# EAGLE design SG_CAN_Board_2018 (EAGLE 8.4.2)
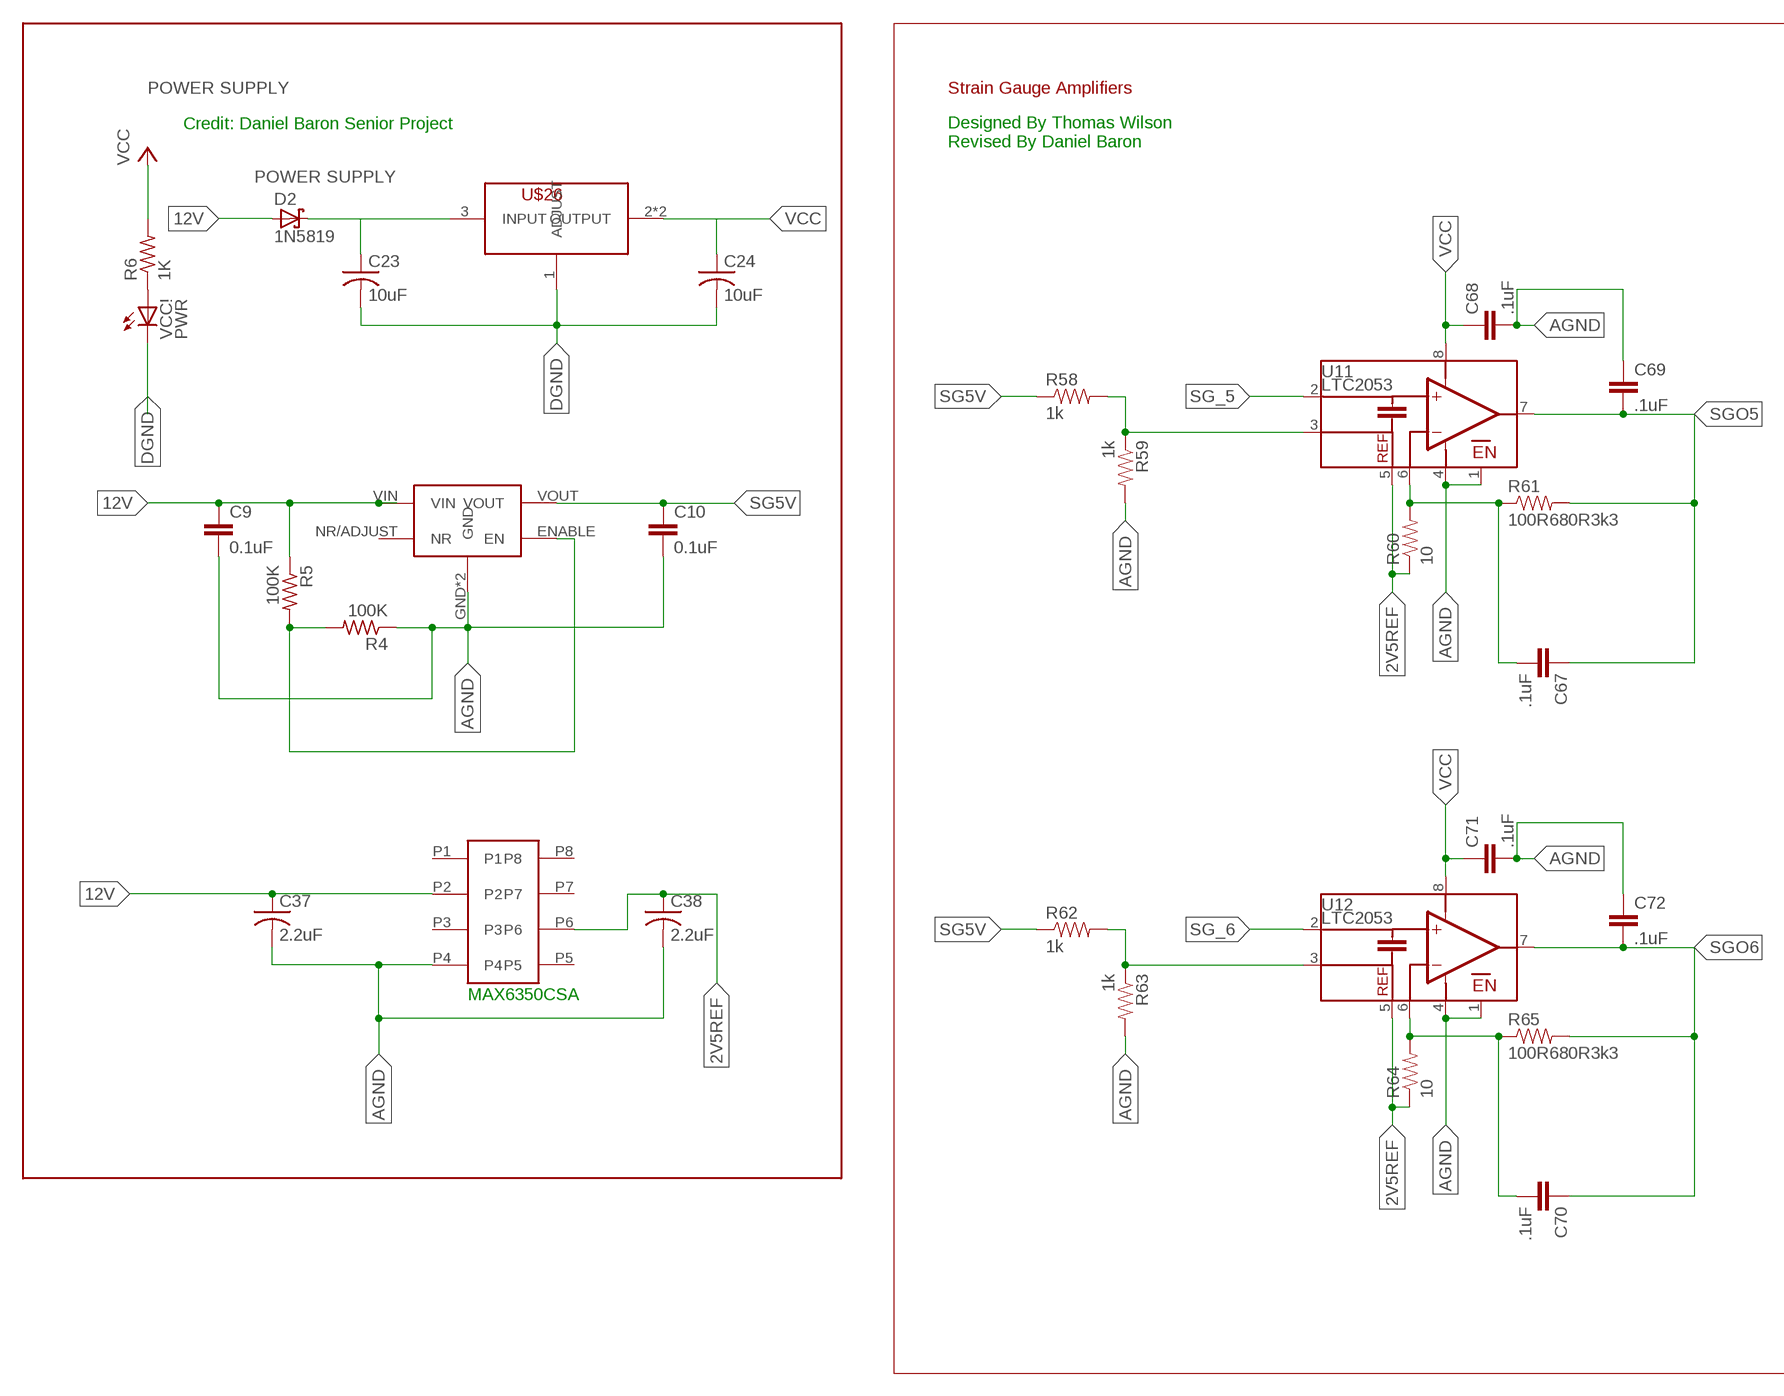
[diagram p0: schematic, sheet 1, part 1 of 2]
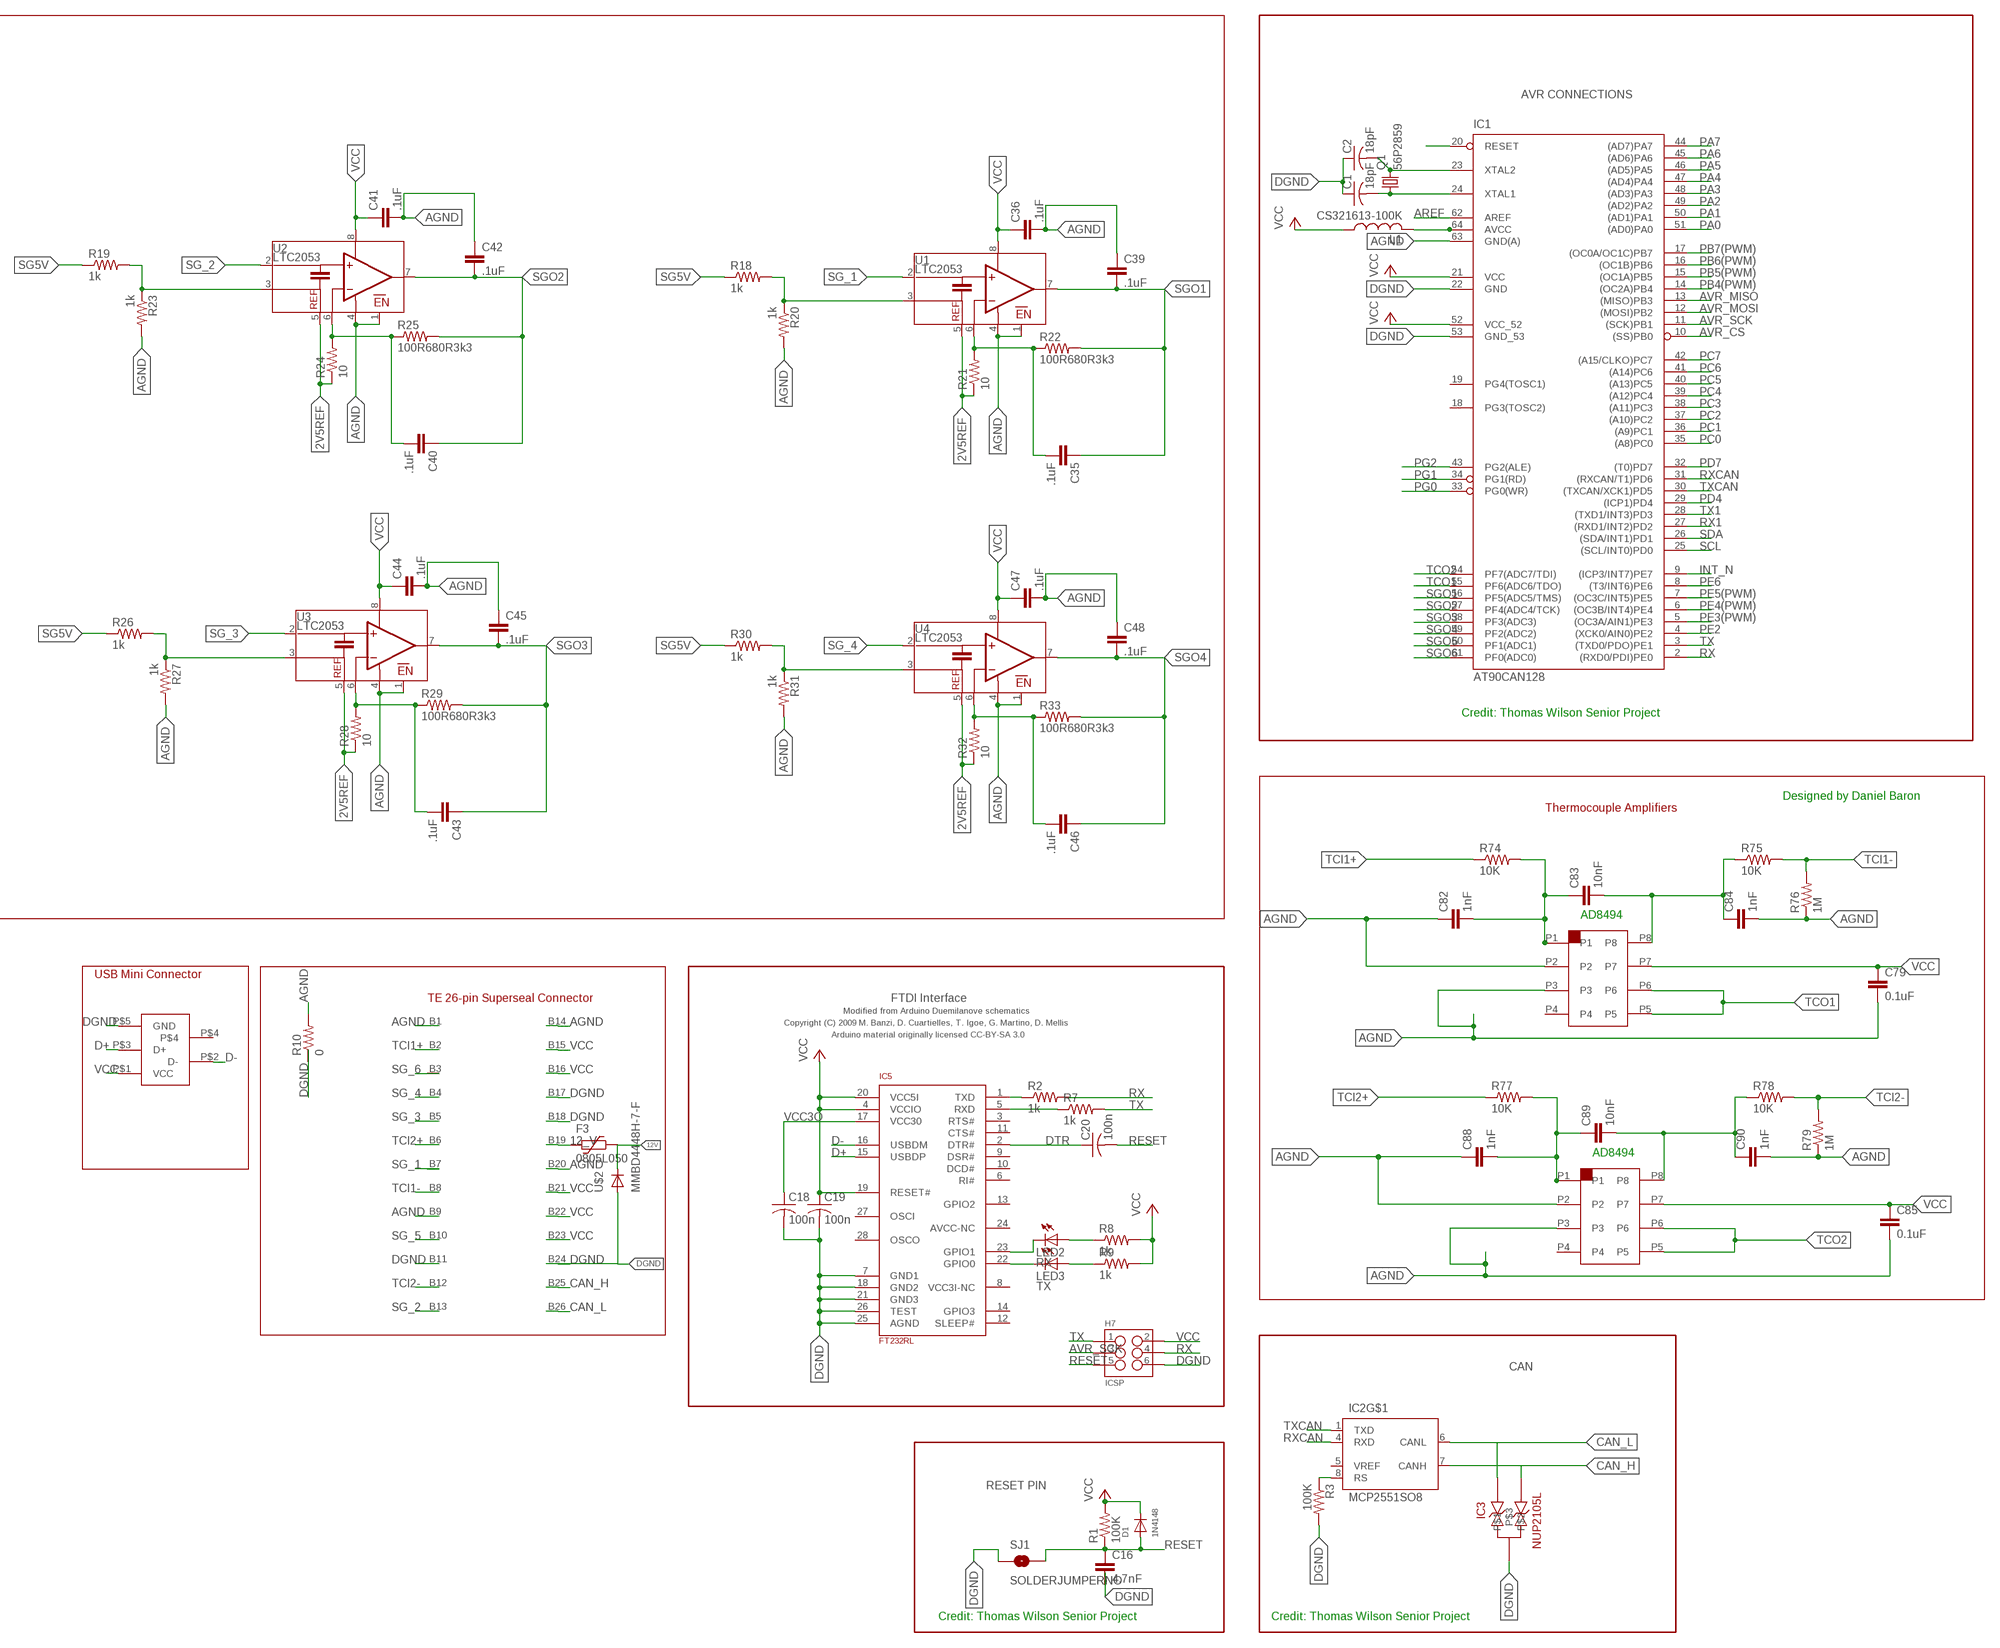
[diagram p1: schematic, sheet 1, part 2 of 2]

## Parts
C1  18pF  C-USC0805  [C0805]
C2  18pF  C-USC0805  [C0805]
C9  0.1uF  C-EUC0603  [C0603]
C10  0.1uF  C-EUC0603  [C0603]
C16  4.7nF  CAP0603-CAP  [0603-CAP]
C18  100n  C-USC0805  [C0805]
C19  100n  C-USC0805  [C0805]
C20  100n  C-USC0805  [C0805]
C23  10uF  C-USC0603  [C0603]
C24  10uF  C-USC0603  [C0603]
C35  .1uF  CAP0603-CAP  [0603-CAP]
C36  .1uF  CAP0603-CAP  [0603-CAP]
C37  2.2uF  C-USC0603  [C0603]
C38  2.2uF  C-USC0603  [C0603]
C39  .1uF  CAP0603-CAP  [0603-CAP]
C40  .1uF  CAP0603-CAP  [0603-CAP]
C41  .1uF  CAP0603-CAP  [0603-CAP]
C42  .1uF  CAP0603-CAP  [0603-CAP]
C43  .1uF  CAP0603-CAP  [0603-CAP]
C44  .1uF  CAP0603-CAP  [0603-CAP]
C45  .1uF  CAP0603-CAP  [0603-CAP]
C46  .1uF  CAP0603-CAP  [0603-CAP]
C47  .1uF  CAP0603-CAP  [0603-CAP]
C48  .1uF  CAP0603-CAP  [0603-CAP]
C67  .1uF  CAP0603-CAP  [0603-CAP]
C68  .1uF  CAP0603-CAP  [0603-CAP]
C69  .1uF  CAP0603-CAP  [0603-CAP]
C70  .1uF  CAP0603-CAP  [0603-CAP]
C71  .1uF  CAP0603-CAP  [0603-CAP]
C72  .1uF  CAP0603-CAP  [0603-CAP]
C79  0.1uF  C-EUC0603  [C0603]
C82  1nF  C-EUC0603  [C0603]
C83  10nF  C-EUC0603  [C0603]
C84  1nF  C-EUC0603  [C0603]
C85  0.1uF  C-EUC0603  [C0603]
C88  1nF  C-EUC0603  [C0603]
C89  10nF  C-EUC0603  [C0603]
C90  1nF  C-EUC0603  [C0603]
D1  1N4148  DIODESOD-123  [SOD-123]
D2  1N5819  1N5819-B  [DO41-7.6]
F3  0805L050  [0805L]
H7  ICSP  M03X2SMD_FCI  [2X3_SMD_FCI_54202-G30]
IC1  AT90CAN128  [TQFP64]
IC2  MCP2551SO8  [SO08]
IC3  NUP2105L  [SOT-23]
IC5  FT232RL  [SSOP28]
L1  CS321613-100K  L-USL3216C  [L3216C]
LED2  RX  LEDCHIPLED_0805  [CHIPLED_0805]
LED3  TX  LEDCHIPLED_0805  [CHIPLED_0805]
Q1  56P2859  CRYSTALSMD  [HC49UP]
R1  100K  R-US_R0805  [R0805]
R2  1k  R-US_R0805  [R0805]
R3  100K  R-US_R0805  [R0805]
R4  100K  R-US_M0805  [M0805]
R5  100K  R-US_M0805  [M0805]
R6  1K  R-US_R0805  [R0805]
R7  1k  R-US_R0805  [R0805]
R8  1k  R-US_R0805  [R0805]
R9  1k  R-US_R0805  [R0805]
R10  0  RESISTOR0603  [0603-RES]
R18  1k  RESISTOR0603  [0603-RES]
R19  1k  RESISTOR0603  [0603-RES]
R20  1k  RESISTOR0603  [0603-RES]
R21  10  RESISTOR0603  [0603-RES]
R22  100R680R3k3  RESISTOR0603  [0603-RES]
R23  1k  RESISTOR0603  [0603-RES]
R24  10  RESISTOR0603  [0603-RES]
R25  100R680R3k3  RESISTOR0603  [0603-RES]
R26  1k  RESISTOR0603  [0603-RES]
R27  1k  RESISTOR0603  [0603-RES]
R28  10  RESISTOR0603  [0603-RES]
R29  100R680R3k3  RESISTOR0603  [0603-RES]
R30  1k  RESISTOR0603  [0603-RES]
R31  1k  RESISTOR0603  [0603-RES]
R32  10  RESISTOR0603  [0603-RES]
R33  100R680R3k3  RESISTOR0603  [0603-RES]
R58  1k  RESISTOR0603  [0603-RES]
R59  1k  RESISTOR0603  [0603-RES]
R60  10  RESISTOR0603  [0603-RES]
R61  100R680R3k3  RESISTOR0603  [0603-RES]
R62  1k  RESISTOR0603  [0603-RES]
R63  1k  RESISTOR0603  [0603-RES]
R64  10  RESISTOR0603  [0603-RES]
R65  100R680R3k3  RESISTOR0603  [0603-RES]
R74  10K  RESISTOR0603  [0603-RES]
R75  10K  RESISTOR0603  [0603-RES]
R76  1M  RESISTOR0603  [0603-RES]
R77  10K  RESISTOR0603  [0603-RES]
R78  10K  RESISTOR0603  [0603-RES]
R79  1M  RESISTOR0603  [0603-RES]
SJ1  SOLDERJUMPERNO  [SJ_2S-NO]
U1  LTC2053  [MSOP8]
U2  LTC2053  [MSOP8]
U3  LTC2053  [MSOP8]
U4  LTC2053  [MSOP8]
U11  LTC2053  [MSOP8]
U12  LTC2053  [MSOP8]
U$1  1734753-1_MINIUSB_CON  [1734753-1_MINIUSB_CON]
U$2  MMBD4448H-7-F  [SOT23-3]
U$3  SUPERSEAL1.0_26POS  [SUPERSEAL1.0_26POS]
U$5  REG-104GA-5  [REG104GA-5]
U$10V2V5  MAX6350CSA  [8-SOIC]
U$11  AD8495  [8MSOP]
U$12  AD8495  [8MSOP]
U$26  NCP1117  [SOT-223-4]
VCC!  PWR  LEDCHIPLED_0805  [CHIPLED_0805]

## Nets
2V5REF: C38.1 R21.1 R24.1 R28.1 R32.1 R60.1 R64.1 U1.5(REF) U2.5(REF) U3.5(REF) U4.5(REF) U11.5(REF) U12.5(REF) U$10V2V5.P6
5V_REG_IN: C23.1 D2.C U$26.3(INPUT)
12_V: F3.2 U$3.B19
12V: C9.1 C37.1 D2.A F3.1 R5.1 U$2.3(C) U$5.VIN U$10V2V5.P2
AGND: C9.2 C10.2 C36.2 C37.2 C38.2 C39.1 C41.2 C42.1 C44.2 C45.1 C47.2 C48.1 C68.2 C69.1 C71.2 C72.1 C79.2 C82.1 C84.2 C85.2 C88.1 C90.2 IC1.63(GND(A)) R4.1 R10.2 R20.2 R23.2 R27.2 R31.2 R59.2 R63.2 R76.1 R79.1 U1.1(EN) U1.4(V-) U2.1(EN) U2.4(V-) U3.1(EN) U3.4(V-) U4.1(EN) U4.4(V-) U11.1(EN) U11.4(V-) U12.1(EN) U12.4(V-) U$3.B1 U$3.B9 U$3.B14 U$3.B20 U$5.GND U$5.HEATGND(GND) U$10V2V5.P4 U$11.P2 U$11.P3 U$12.P2 U$12.P3
AREF: IC1.62(AREF)
AVR_CS: IC1.10((SS)PB0)
AVR_MISO: IC1.13((MISO)PB3)
AVR_MOSI: IC1.12((MOSI)PB2)
AVR_SCK: H7.3 IC1.11((SCK)PB1)
CAN_H: IC2.7(CANH) IC3.2 U$3.B25
CAN_L: IC2.6(CANL) IC3.1 U$3.B26
D+: IC5.15(USBDP) U$1.P$3(D+)
D-: IC5.16(USBDM) U$1.P$2(D-)
DGND: C1.1 C2.1 C18.2 C19.2 C23.2 C24.2 H7.6 IC1.22(GND) IC1.53(GND_53) IC3.3 IC5.7(GND1) IC5.18(GND2) IC5.21(GND3) IC5.25(AGND) IC5.26(TEST) R3.2 R10.1 SJ1.1 U$1.P$5(GND) U$2.1(A) U$3.B11 U$3.B17 U$3.B18 U$3.B24 U$26.1(ADJUST) VCC!.C
DTR: C20.1 IC5.2(DTR#)
INT_N: IC1.9((ICP3/INT7)PE7)
M8RXD: IC5.1(TXD) R2.1
M8TXD: IC5.5(RXD) R7.1
N$1: C35.2 R21.2 R22.1 U1.6(RG)
N$2: R4.2 R5.2 U$5.ENABLE(EN)
N$4: R18.2 R20.1 U1.3(+IN)
N$5: R19.2 R23.1 U2.3(+IN)
N$6: IC2.8(RS) R3.1
N$7: C40.2 R24.2 R25.1 U2.6(RG)
N$8: R26.2 R27.1 U3.3(+IN)
N$9: R6.1 VCC!.A
N$10: C43.2 R28.2 R29.1 U3.6(RG)
N$11: C1.2 IC1.24(XTAL1) Q1.1
N$12: R30.2 R31.1 U4.3(+IN)
N$14: C46.2 R32.2 R33.1 U4.6(RG)
N$22: IC1.64(AVCC) L1.2
N$28: R58.2 R59.1 U11.3(+IN)
N$29: C67.2 R60.2 R61.1 U11.6(RG)
N$30: R62.2 R63.1 U12.3(+IN)
N$31: C70.2 R64.2 R65.1 U12.6(RG)
N$32: IC5.23(GPIO1) LED2.C
N$34: IC5.22(GPIO0) LED3.C
N$35: LED2.A R8.1
N$36: LED3.A R9.1
N$40: C88.2 C89.1 R77.2 U$12.P1
N$41: C83.2 C84.1 R75.1 U$11.P8
N$42: C89.2 C90.1 R78.1 U$12.P8
N$43: C82.2 C83.1 R74.2 U$11.P1
PA0: IC1.51((AD0)PA0)
PA1: IC1.50((AD1)PA1)
PA2: IC1.49((AD2)PA2)
PA3: IC1.48((AD3)PA3)
PA4: IC1.47((AD4)PA4)
PA5: IC1.46((AD5)PA5)
PA6: IC1.45((AD6)PA6)
PA7: IC1.44((AD7)PA7)
PB4(PWM): IC1.14((OC2A)PB4)
PB5(PWM): IC1.15((OC1A)PB5)
PB6(PWM): IC1.16((OC1B)PB6)
PB7(PWM): IC1.17((OC0A/OC1C)PB7)
PC0: IC1.35((A8)PC0)
PC1: IC1.36((A9)PC1)
PC2: IC1.37((A10)PC2)
PC3: IC1.38((A11)PC3)
PC4: IC1.39((A12)PC4)
PC5: IC1.40((A13)PC5)
PC6: IC1.41((A14)PC6)
PC7: IC1.42((A15/CLKO)PC7)
PD4: IC1.29((ICP1)PD4)
PD7: IC1.32((T0)PD7)
PE2: IC1.4((XCK0/AIN0)PE2)
PE3(PWM): IC1.5((OC3A/AIN1)PE3)
PE4(PWM): IC1.6((OC3B/INT4)PE4)
PE5(PWM): IC1.7((OC3C/INT5)PE5)
PE6: IC1.8((T3/INT6)PE6)
PG0: IC1.33(PG0(WR))
PG1: IC1.34(PG1(RD))
PG2: IC1.43(PG2(ALE))
RESET: C16.1 C20.2 D1.A H7.5 IC1.20(RESET) R1.1 SJ1.2
RX: H7.4 IC1.2((RXD0/PDI)PE0) R2.2
RX1: IC1.27((RXD1/INT2)PD2)
RXCAN: IC1.31((RXCAN/T1)PD6) IC2.4(RXD)
SCL: IC1.25((SCL/INT0)PD0)
SDA: IC1.26((SDA/INT1)PD1)
SG5V: C10.1 R18.1 R19.1 R26.1 R30.1 R58.1 R62.1 U$5.VOUT
SG_1: U1.2(-IN) U$3.B7
SG_2: U2.2(-IN) U$3.B13
SG_3: U3.2(-IN) U$3.B5
SG_4: U4.2(-IN) U$3.B4
SG_5: U11.2(-IN) U$3.B10
SG_6: U12.2(-IN) U$3.B3
SGO1: C35.1 C39.2 IC1.56(PF5(ADC5/TMS)) R22.2 U1.7(OUT)
SGO2: C40.1 C42.2 IC1.57(PF4(ADC4/TCK)) R25.2 U2.7(OUT)
SGO3: C43.1 C45.2 IC1.58(PF3(ADC3)) R29.2 U3.7(OUT)
SGO4: C46.1 C48.2 IC1.59(PF2(ADC2)) R33.2 U4.7(OUT)
SGO5: C67.1 C69.2 IC1.60(PF1(ADC1)) R61.2 U11.7(OUT)
SGO6: C70.1 C72.2 IC1.61(PF0(ADC0)) R65.2 U12.7(OUT)
TCI1+: R74.1 U$3.B2
TCI1-: R75.2 R76.2 U$3.B8
TCI2+: R77.1 U$3.B6
TCI2-: R78.2 R79.2 U$3.B12
TCO1: IC1.55(PF6(ADC6/TDO)) U$11.P5 U$11.P6
TCO2: IC1.54(PF7(ADC7/TDI)) U$12.P5 U$12.P6
TX: H7.1 IC1.3((TXD0/PDO)PE1) R7.2
TX1: IC1.28((TXD1/INT3)PD3)
TXCAN: IC1.30((TXCAN/XCK1)PD5) IC2.1(TXD)
VCC: C19.1 C24.1 C36.1 C41.1 C44.1 C47.1 C68.1 C71.1 C79.1 C85.1 D1.C H7.2 IC1.21(VCC) IC1.52(VCC_52) IC5.4(VCCIO) IC5.19(RESET#) IC5.20(VCC5I) L1.1 R1.2 R6.2 R8.2 R9.2 U1.8(V+) U2.8(V+) U3.8(V+) U4.8(V+) U11.8(V+) U12.8(V+) U$1.P$1(VCC) U$3.B15 U$3.B16 U$3.B21 U$3.B22 U$3.B23 U$11.P7 U$12.P7 U$26.2(OUTPUT) U$26.4(OUTPUT)
VCC3O: C18.1 IC5.17(VCC30)
XTAL1: C2.2 IC1.23(XTAL2) Q1.2
Unconnected: C16.2 IC1.18(PG3(TOSC2)) IC1.19(PG4(TOSC1)) IC2.5(VREF) IC5.3(RTS#) IC5.6(RI#) IC5.8(VCC3I-NC) IC5.9(DSR#) IC5.10(DCD#) IC5.11(CTS#) IC5.12(SLEEP#) IC5.13(GPIO2) IC5.14(GPIO3) IC5.24(AVCC-NC) IC5.27(OSCI) IC5.28(OSCO) U$1.P$4 U$5.NR/ADJUST(NR) U$10V2V5.P1 U$10V2V5.P3 U$10V2V5.P5 U$10V2V5.P7 U$10V2V5.P8 U$11.P4 U$12.P4

## Notes on the sheet
- POWER SUPPLY | Strain Gauge Amplifiers
- Credit: Daniel Baron Senior Project
- Designed By Thomas Wilson
  Revised By Daniel Baron
- AVR CONNECTIONS
- POWER SUPPLY
- MAX6350CSA
- Credit: Thomas Wilson Senior Project
- Designed by Daniel Baron
- Thermocouple Amplifiers
- AD8494
- USB Mini Connector
- TE 26-pin Superseal Connector | FTDI Interface
- Modified from Arduino Duemilanove schematics
- Copyright (C) 2009 M. Banzi, D. Cuartielles, T. Igoe, G. Martino, D. Mellis
- Arduino material originally licensed CC-BY-SA 3.0
- AD8494
- CAN
- RESET PIN
- Credit: Thomas Wilson Senior Project | Credit: Thomas Wilson Senior Project

## Power pins joined to a net without a drawn wire
DGND: IC2.2(GND)
VCC: IC2.3(VCC)

## Library data of the parts
C1 C2 C18-C20 C23 C24 C37 C38 = rcl:C-US: CAPACITOR, American symbol
C9 C10 C79 C82-C85 C88-C90 = rcl:C-EU: CAPACITOR, European symbol
C16 = SparkFun-Capacitors:CAP: Capacitor Standard 0603 ceramic capacitor, and 0.1" leaded capacitor.
C35 C36 C39-C48 C67-C72 = SparkFun-Passives:CAP: Capacitor Standard 0603 ceramic capacitor, and 0.1" leaded capacitor.
D1 = adafruit:DIODE: Diode SMADIODE - SMA Surface Mount Package 20V 1A Schottky Diode Digikey: 641-1014-6-ND DO-1N4148 - Through Hole Small Current Diode SOD-123 20V 1 A (.5mV Vf) Schottky Diode - Digikey: MBRX120TPMSCT-ND SOD-323 10V 570mA (.38mV Vf, 3ns) Schottky Diode - Digikey: ZLLS410CT-ND SOD-523 30V 30mA Schottky Diode (RB751S-40TE61) - Digikey: RB751S-40TE61CT-ND SOT23-R/W - SOT23 Package (R = Solder Paste/Reflow Ovens, W = Hand-Soldering) BAT54Film 40V 300mA - Digikey: 497-7162-1-ND
D2 = diode:1N581*: 1.0A SCHOTTKY BARRIER RECTIFIER Source: http://www.diodes.com/datasheets/ds23001.pdf
F3 = LittleFuse:?: Polyfuse Resettable PTC Source: http://www.littelfuse.com/products/resettable-ptcs.aspx; MF: Littelfuse; MPN: 0805L050; OC_FARNELL: 1832103; OC_NEWARK: 18M4776
H7 = SparkFun-Connectors:M03X2: 2x3 .1" header. Shrouded, with keying- CONN-10681 SMT- CONN-11415 Pogo pins- HW-11044
IC1 = at90can128:AT90CAN128
IC2 = can:MCP2551: CAN Tranceiver Microchip
IC3 = Artificial Science:NUP2105L
IC5 = SmartPrj:FT232RL
L1 = rcl:L-US: INDUCTOR, American symbol
LED2 LED3 VCC! = led:LED: LED OSRAM: - CHIPLED LG R971, LG N971, LY N971, LG Q971, LY Q971, LO R971, LY R971 LH N974, LH R974 LS Q976, LO Q976, LY Q976 LO Q996 - Hyper CHIPLED LW Q18S LB Q993, LB Q99A, LB R99A - SideLED LS A670, LO A670, LY A670, LG A670, LP A670 LB A673, LV A673, LT A673, LW A673 LH A674 LY A675 LS A676, LA A676, LO A676, LY A676, LW A676 LS A679, LY A679, LG A679 - Hyper Micro SIDELED® LS Y876, LA Y876, LO Y876, LY Y876 LT Y87S - SmartLED LW L88C, LW L88S LB L89C, LB L89S, LG L890 LS L89K, LO L89K, LY L89K LS L896, LA L896, LO L896, LY L896 - TOPLED LS T670, LO T670, LY T670, LG T670, LP T670 LSG T670, LSP T670, LSY T670, LOP T670, LYG T670 LG T671, LOG T671, LSG T671 LB T673, LV T673, LT T673, LW T673 LH T674 LS T676, LA T676, LO T676, LY T676, LB T676, LH T676, LSB T676, LW T676 LB T67C, LV T67C, LT T67C, LS T67K, LO T67K, LY T67K, LW E67C LS E67B, LA E67B, LO E67B, LY E67B, LB E67C, LV E67C, LT E67C LW T67C LS T679, LY T679, LG T679 LS T770, LO T770, LY T770, LG T770, LP T770 LB T773, LV T773, LT T773, LW T773 LH T774 LS E675, LA E675, LY E675, LS T675 LS T776, LA T776, LO T776, LY T776, LB T776 LHGB T686 LT T68C, LB T68C - Hyper Mini TOPLED® LB M676 - Mini TOPLED Santana® LG M470 LS M47K, LO M47K, LY M47K Source: http://www.osram.convergy.de LUXEON: - LUMILED® LXK2-PW12-R00, LXK2-PW12-S00, LXK2-PW14-U00, LXK2-PW14-V00 LXK2-PM12-R00, LXK2-PM12-S00, LXK2-PM14-U00 LXK2-PE12-Q00, LXK2-PE12-R00, LXK2-PE12-S00, LXK2-PE14-T00, LXK2-PE14-U00 LXK2-PB12-K00, LXK2-PB12-L00, LXK2-PB12-M00, LXK2-PB14-N00, LXK2-PB14-P00, LXK2-PB14-Q00 LXK2-PR12-L00, LXK2-PR12-M00, LXK2-PR14-Q00, LXK2-PR14-R00 LXK2-PD12-Q00, LXK2-PD12-R00, LXK2-PD12-S00 LXK2-PH12-R00, LXK2-PH12-S00 LXK2-PL12-P00, LXK2-PL12-Q00, LXK2-PL12-R00 Source: www.luxeon.com KINGBRIGHT: KA-3528ASYC Source: www.kingbright.com
Q1 = SparkFun-FreqCtrl:CRYSTAL: Various standard crystals. Proven footprints. Spark Fun Electronics SKU : COM-00534
R1-R9 = rcl:R-US_: RESISTOR, American symbol
R10 R18-R33 R58-R65 R74-R79 = SparkFun-Resistors:RESISTOR: Resistor Basic schematic elements and footprints for 0603, 1206, and PTH resistors.
SJ1 = SparkFun-Passives:SOLDERJUMPER: Solder Jumper Standard SMD solder jumper. Used to automate production. Two varients : Normally Open and Normally Closed are the same, but have different paste layers. NC will have a large amount of paste and should jumper during reflow.
U1-U4 U11 U12 = linear-technology:LTC2053: DK: LTC2053CMS8#PBF-ND
U$1 = us-te-con:1734753-1_MINIUSB_CON
U$2 = diodes-inc:MMBD4448H-7-F
U$3 = TE:SUPERSEAL1.0_26POS
U$5 = DashAndCAN library:REG-104GA-5
U$10V2V5 = DashAndCAN library:MAX6350CSA
U$11 U$12 = DashAndCAN library:AD8495
U$26 = on-semiconductor:NCP1117

## Board
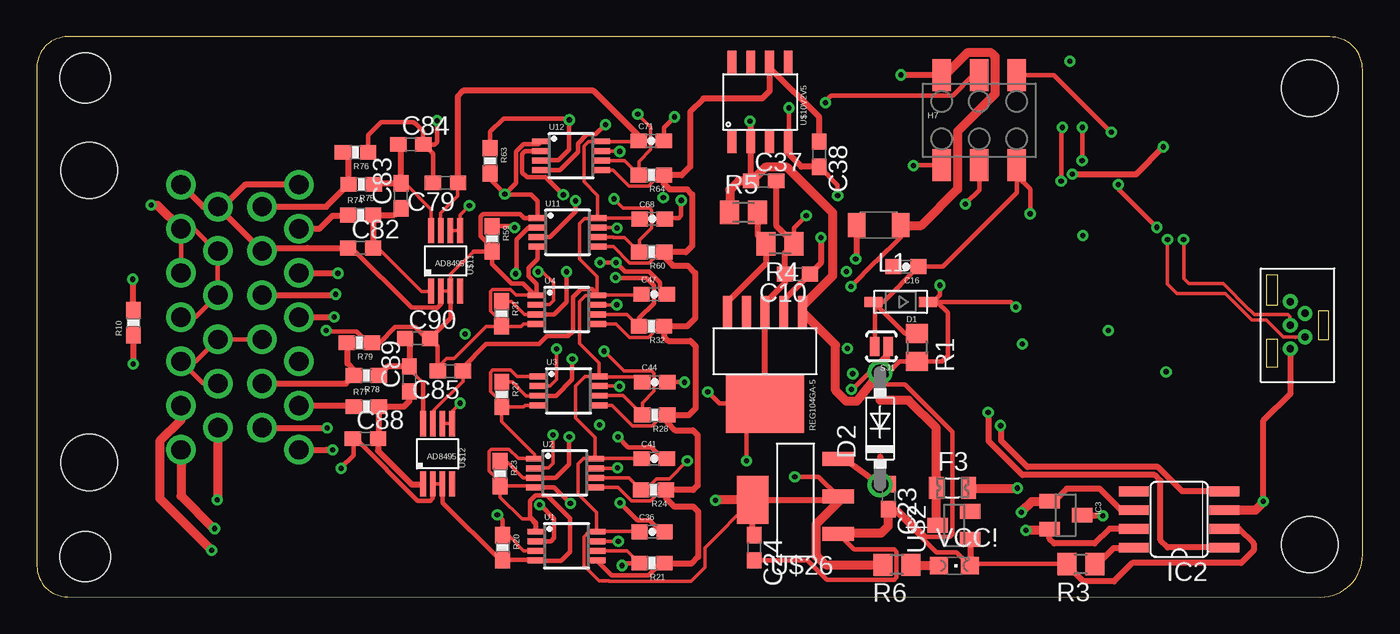
[diagram p2: board, top side]
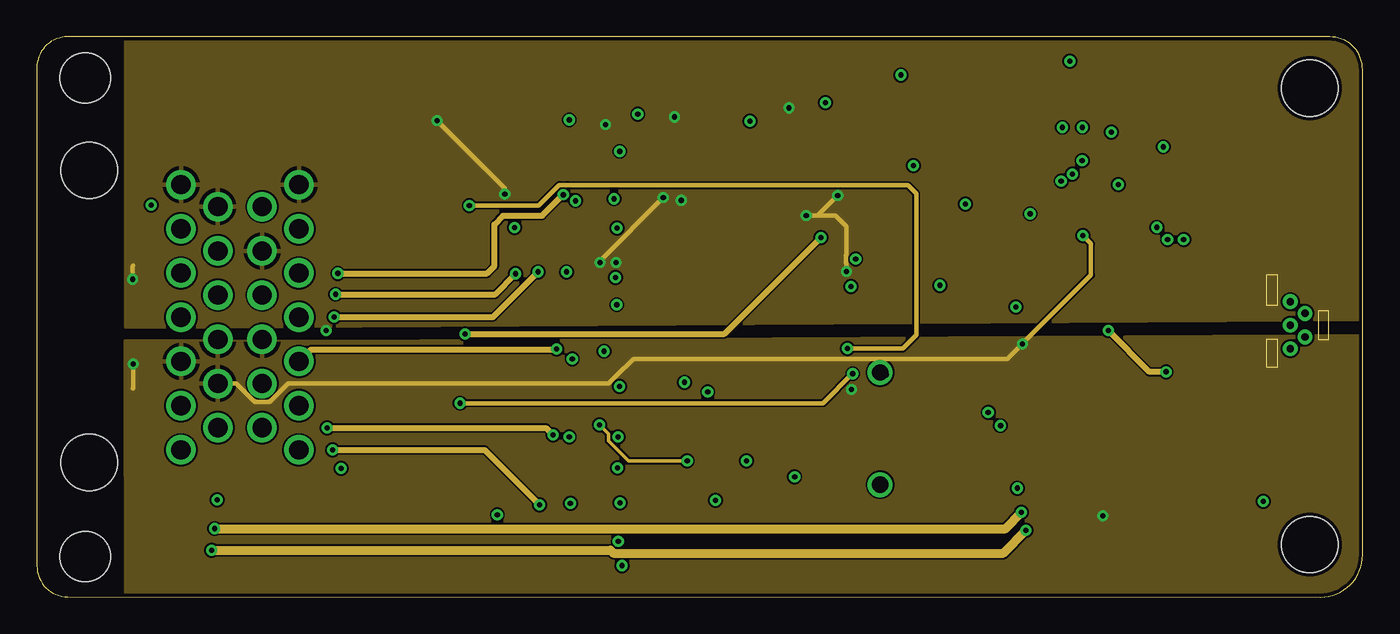
[diagram p3: board, inner layer Route6]
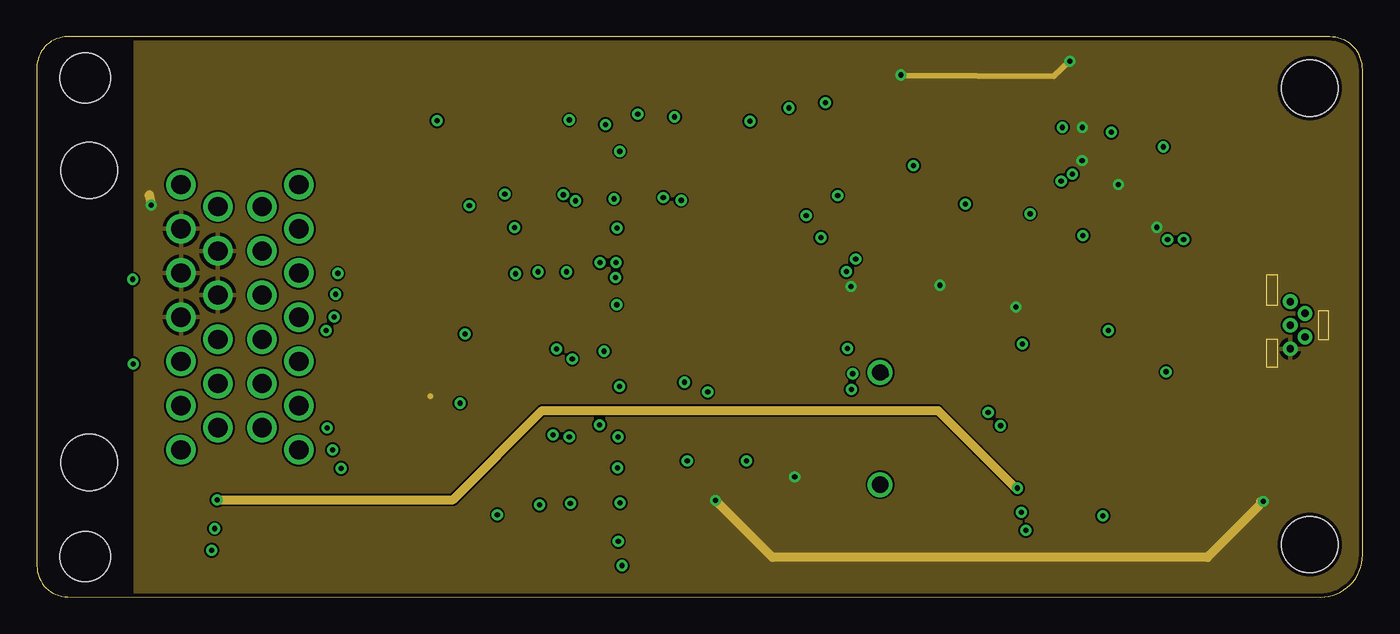
[diagram p4: board, inner layer Route11]
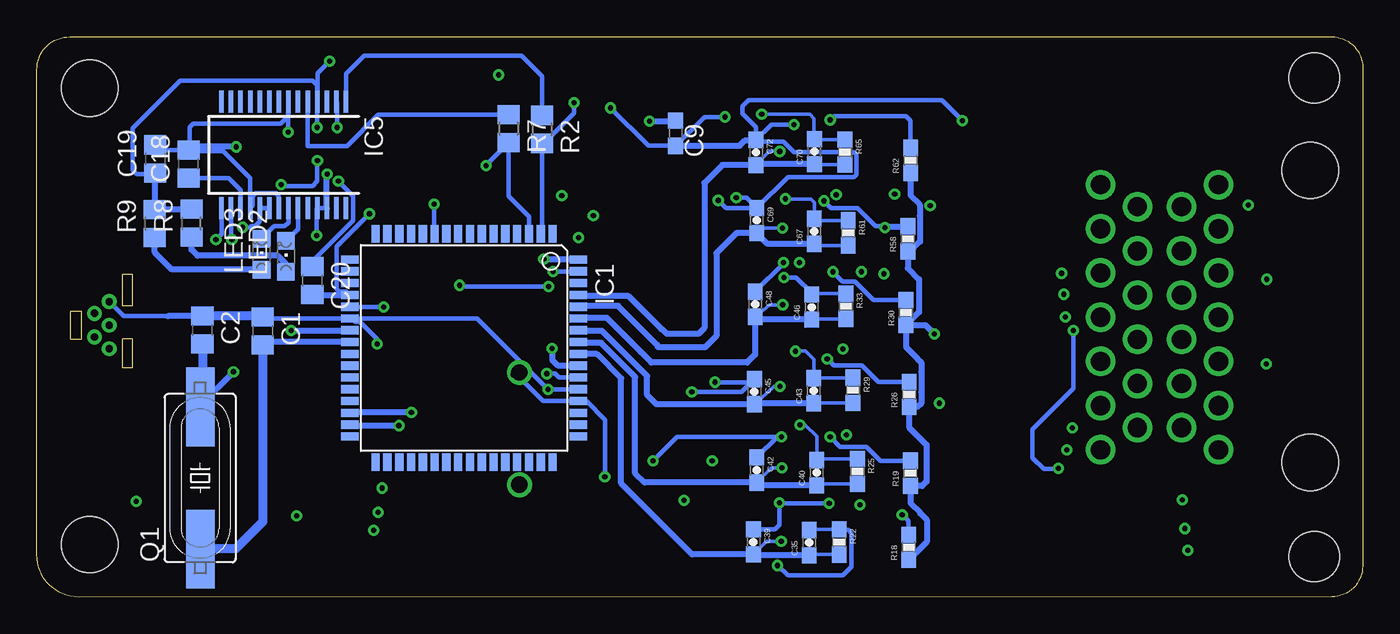
[diagram p5: board, bottom side, seen from below]

Size 89.94 x 38.02 mm. Coordinates in mm from the lower left corner, seen from the top.
Outline: 0,35.93 0,2.11 arc90 2.09,0.01 87.08,0 arc90 89.94,2.86 89.94,35.81 arc90 87.73,38.02 2.09,38.02 arc90 0,35.93
Copper layers (1*6*11*16): Top 0.053340625mm / dielectric 7.5mil / Route6 0.035559375mm / dielectric 40mil / Route11 0.035559375mm / dielectric 7.5mil / Bottom 0.053340625mm
Design rules "default *": minimum track width 6mil, minimum drill 8mil, track to track 5mil, track to pad 5mil, pad to pad 5mil, via to via 5mil, smd to smd 6mil, copper to edge 10mil, drill to drill 10mil, minimum pad ring 10mil, minimum via ring 8mil, stop-mask expansion 4mil, vias tented up to drill 0mil, thermal gap 10mil
Holes 3.81 mm at 3.56,28.96 3.56,9.14 86.36,3.56 86.36,34.54

### Footprints (pad centres in the part's own frame; a part is rotated, then mirrored left to right if it is on the bottom)
C0805 = smd 1.3 x 1.5: 1 -0.95,0; 2 0.95,0
C0603 = smd 1.1 x 1: 1 -0.85,0; 2 0.85,0
0603-CAP = smd 1.1 x 1: 1 -0.85,0; 2 0.85,0
SOD-123 = smd 1.2 x 0.7: A 1.85,0; C -1.85,0
DO41-7.6 = drill 1.1 pad 1.7: A 3.81,0; C -3.81,0
0805L = smd 1 x 1.5: 1 -1.1,0; 2 1.1,0
2X3_SMD_FCI_54202-G30 = smd 1.27 x 2.18: 1 -2.54,-3.05; 2 -2.54,3.05; 3 0,-3.05; 4 0,3.05; 5 2.54,-3.05; 6 2.54,3.05
TQFP64 = smd 1.194 x 0.559: 1 -7.76,6; 2 -7.76,5.2; 3 -7.76,4.4; 4 -7.76,3.6; 5 -7.76,2.8; 6 -7.76,2; 7 -7.76,1.2; 8 -7.76,0.4; 9 -7.76,-0.4; 10 -7.76,-1.2; 11 -7.76,-2; 12 -7.76,-2.8; 13 -7.76,-3.6; 14 -7.76,-4.4; 15 -7.76,-5.2; 16 -7.76,-6; 33 7.76,-6; 34 7.76,-5.2; 35 7.76,-4.4; 36 7.76,-3.6; 37 7.76,-2.8; 38 7.76,-2; 39 7.76,-1.2; 40 7.76,-0.4; 41 7.76,0.4; 42 7.76,1.2; 43 7.76,2; 44 7.76,2.8; 45 7.76,3.6; 46 7.76,4.4; 47 7.76,5.2; 48 7.76,6 | smd 0.559 x 1.194: 17 -6,-7.76; 18 -5.2,-7.76; 19 -4.4,-7.76; 20 -3.6,-7.76; 21 -2.8,-7.76; 22 -2,-7.76; 23 -1.2,-7.76; 24 -0.4,-7.76; 25 0.4,-7.76; 26 1.2,-7.76; 27 2,-7.76; 28 2.8,-7.76; 29 3.6,-7.76; 30 4.4,-7.76; 31 5.2,-7.76; 32 6,-7.76; 49 6,7.76; 50 5.2,7.76; 51 4.4,7.76; 52 3.6,7.76; 53 2.8,7.76; 54 2,7.76; 55 1.2,7.76; 56 0.4,7.76; 57 -0.4,7.76; 58 -1.2,7.76; 59 -2,7.76; 60 -2.8,7.76; 61 -3.6,7.76; 62 -4.4,7.76; 63 -5.2,7.76; 64 -6,7.76
SO08 = smd 0.66 x 2.032: 1 -1.905,-3.073; 2 -0.635,-3.073; 3 0.635,-3.073; 4 1.905,-3.073; 5 1.905,3.073; 6 0.635,3.073; 7 -0.635,3.073; 8 -1.905,3.073
SOT-23 = smd 1 x 1.4: 1 -0.95,-1.1; 2 0.95,-1.1; 3 0,1.1
SSOP28 = smd 0.381 x 1.499: 1 -4.225,-3.625; 2 -3.575,-3.625; 3 -2.925,-3.625; 4 -2.275,-3.625; 5 -1.625,-3.625; 6 -0.975,-3.625; 7 -0.325,-3.625; 8 0.325,-3.625; 9 0.975,-3.625; 10 1.625,-3.625; 11 2.275,-3.625; 12 2.925,-3.625; 13 3.575,-3.625; 14 4.225,-3.625; 15 4.225,3.625; 16 3.575,3.625; 17 2.925,3.625; 18 2.275,3.625; 19 1.625,3.625; 20 0.975,3.625; 21 0.325,3.625; 22 -0.325,3.625; 23 -0.975,3.625; 24 -1.625,3.625; 25 -2.275,3.625; 26 -2.925,3.625; 27 -3.575,3.625; 28 -4.225,3.625
L3216C = smd 1.2 x 1.6: 1 -1.5,0; 2 1.5,0
CHIPLED_0805 = smd 1.2 x 1.2: A 0,-1.05; C 0,1.05
HC49UP = smd 5.334 x 1.93: 1 -4.826,0; 2 4.826,0
R0805 = smd 1.3 x 1.5: 1 -0.95,0; 2 0.95,0
M0805 = smd 1.3 x 1.6: 1 -0.95,0; 2 0.95,0
0603-RES = smd 1.1 x 1: 1 -0.85,0; 2 0.85,0
SJ_2S-NO = smd 0.635 x 1.27: 1 -0.45,0; 2 0.45,0
MSOP8 = smd 0.4 x 1.2: 1 -0.975,-2.05; 2 -0.325,-2.05; 3 0.325,-2.05; 4 0.975,-2.05; 5 0.975,2.05; 6 0.325,2.05; 7 -0.325,2.05; 8 -0.975,2.05
1734753-1_MINIUSB_CON = drill 0.5: P$1 -0.5,-1.6; P$2 0.5,-0.8; P$3 -0.5,0; P$4 0.5,0.8; P$5 -0.5,1.6
SOT23-3 = smd 1 x 1.4: 1 -0.95,-1.1; 2 0.95,-1.1; 3 0,1.1
SUPERSEAL1.0_26POS = drill 1.3 pad 2: B1 -9.17,4.73; B2 -6.17,4.73; B3 -3.17,4.73; B4 -0.17,4.73; B5 2.83,4.73; B6 5.83,4.73; B7 8.83,4.73; B8 -7.67,2.23; B9 -4.67,2.23; B10 -1.67,2.23; B11 1.33,2.23; B12 4.33,2.23; B13 7.33,2.23; B14 -7.67,-0.77; B15 -4.67,-0.77; B16 -1.67,-0.77; B17 1.33,-0.77; B18 4.33,-0.77; B19 7.33,-0.77; B20 -9.17,-3.27; B21 -6.17,-3.27; B22 -3.17,-3.27; B23 -0.17,-3.27; B24 2.83,-3.27; B25 5.83,-3.27; B26 8.83,-3.27 | hole 3.4: -16.42,-9.77; 16.08,-9.77
REG104GA-5 = smd 0.6 x 2.2: ENABLE 2.54,-6.2; GND 0,-6.2; NR/ADJUST 1.27,-6.2; VIN -2.54,-6.2; VOUT -1.27,-6.2 | smd 5.3 x 4: HEATGND 0,0
8-SOIC = smd 0.6 x 1.55: P1 -1.905,-2.7; P2 -0.635,-2.7; P3 0.635,-2.7; P4 1.905,-2.7; P5 1.905,2.7; P6 0.635,2.7; P7 -0.635,2.7; P8 -1.905,2.7
8MSOP = smd 0.4 x 1.7: P1 -0.975,-2.05; P2 -0.325,-2.05; P3 0.325,-2.05; P4 0.975,-2.05; P5 0.975,2.05; P6 0.325,2.05; P7 -0.325,2.05; P8 -0.975,2.05
SOT-223-4 = smd 0.95 x 2.15: 1 -2.3,-2.9; 2 0.24,-2.9; 3 2.78,-2.9 | smd 3.25 x 2.15: 4 0,2.9

### Placement (x,y rotation side)
C1  74.62,18.05 270 bottom
C2  78.71,18.12 270 bottom
C9  46.62,31.48 270 bottom
C10  51.6,21.93 180 top
C16  58.96,22.43 180 top
C18  79.65,29.39 90 bottom
C19  81.91,29.74 90 bottom
C20  71.25,21.49 270 bottom
C23  57.77,6.82 270 top
C24  48.67,3.35 270 top
C35  37.54,3.69 90 bottom
C36  41.74,4.43 0 top
C37  49.31,28.25 0 top
C38  53.08,30.05 270 top
C39  41.33,3.75 270 bottom
C40  37.04,8.44 90 bottom
C41  41.88,9.39 0 top
C42  41.11,8.62 270 bottom
C43  37.23,14 90 bottom
C44  41.92,14.59 0 top
C45  41.27,13.94 270 bottom
C46  37.38,19.68 90 bottom
C47  41.88,20.54 0 top
C48  41.22,19.87 270 bottom
C67  37.2,24.82 90 bottom
C68  41.75,25.66 0 top
C69  41.11,25.56 270 bottom
C70  37.19,30.23 90 bottom
C71  41.69,30.96 0 top
C72  41.15,30.18 270 bottom
C79  27.72,28.11 180 top
C82  21.96,23.7 0 top
C83  24.71,27.24 90 top
C84  25.38,30.73 0 top
C85  28.05,15.35 180 top
C88  22.29,10.76 0 top
C89  25.28,14.8 90 top
C90  25.83,17.56 0 top
D1  58.6,20.03 180 top
D2  57.21,11.44 90 top
F3  62.12,7.42 0 top
H7  63.93,32.36 0 top
IC1  60.96,16.91 270 bottom
IC2  77.5,5.27 90 top
IC3  69.8,5.56 270 top
IC5  73.2,30.01 180 bottom
L1  57.11,25.25 180 top
LED2  73.04,23.12 0 bottom
LED3  74.69,23.27 0 bottom
Q1  78.86,8.08 90 bottom
R1  59.7,16.94 270 top
R2  55.67,31.74 270 bottom
R3  70.82,2.24 180 top
R4  50.42,23.98 180 top
R5  47.94,26.1 0 top
R6  58.35,2.2 180 top
R7  57.95,31.79 270 bottom
R8  79.45,25.38 90 bottom
R9  81.94,25.35 90 bottom
R10  6.55,18.62 90 top
R18  30.79,3.38 90 bottom
R19  30.68,8.4 90 bottom
R20  31.6,3.36 270 top
R21  41.73,2.3 180 top
R22  35.51,3.74 270 bottom
R23  31.43,8.38 270 top
R24  41.84,7.28 180 top
R25  34.28,8.52 270 bottom
R26  30.77,13.75 90 bottom
R27  31.54,13.75 270 top
R28  41.92,12.36 180 top
R29  34.57,14.03 270 bottom
R30  30.98,19.31 90 bottom
R31  31.52,19.23 270 top
R32  41.71,18.37 180 top
R33  35.06,19.74 270 bottom
R58  30.86,24.32 90 bottom
R59  30.89,24.32 270 top
R60  41.72,23.42 180 top
R61  34.89,24.72 270 bottom
R62  30.67,29.64 90 bottom
R63  30.75,29.61 270 top
R64  41.69,28.64 180 top
R65  35.12,30.2 270 bottom
R74  21.96,25.93 0 top
R75  22.01,28.02 180 top
R76  21.62,30.17 180 top
R77  22.36,12.93 0 top
R78  22.35,15.04 180 top
R79  21.88,17.26 180 top
SJ1  57.3,17.01 180 top
U1  35.93,3.47 270 top
U2  35.82,8.42 270 top
U3  36.07,13.99 270 top
U4  35.95,19.51 270 top
U11  36,24.75 270 top
U12  36.25,29.95 270 top
U$1  85.53,18.45 0 top
U$2  62.22,4.86 90 top
U$3  13.05,18.82 270 top
U$5  49.4,13.13 180 top
U$10V2V5  49.07,33.6 0 top
U$11  27.73,22.82 0 top
U$12  27.19,9.72 0 top
U$26  51.47,6.59 90 top
VCC!  62.25,2.13 270 top

### Tracks (layer width: path | path; a pad name or v marks a point on that pad's centre or on a via)
2V5REF
  Top 0.254: U3.5 39.01,13.02 40.42,11.6 41.73,11.6 42.48,12.36 R28.1 | U4.5 39.28,18.54 40.2,17.62 41.51,17.62 42.26,18.37 R32.1 | U11.5 39.11,23.78 40.21,22.67 41.53,22.67 42.28,23.42 42.53,23.42 R60.1 | U12.5 39.1,28.98 40.19,27.89 41.5,27.89 42.25,28.64 R64.1 | U2.5 39.41,7.45 40.33,6.53 41.64,6.53 42.4,7.28 R24.1 | 42.29,2.3 R21.1
  Top 0.305: R21.1 42.32,2.3 41.5,1.48 39,1.48 U1.5
  Top 0.406: 49.7,35.94 U$10V2V5.P6 | 49.7,35.94 49.7,34.39 49.71,34.39 49.71,34.34 49.2,33.83 45.21,33.83 44.32,32.94 44.32,29.21 43.74,28.63 42.56,28.63 R64.1 42.54,28.06 42.93,27.67 44.12,27.67 44.46,27.33 44.46,23.84 44.03,23.41 42.55,23.41 42.53,23.42 | R60.1 42.57,23.08 43.15,22.49 44.17,22.49 44.67,22 44.67,18.92 44.12,18.38 42.27,18.38 42.26,18.37 | R32.1 42.56,17.65 42.82,17.39 44.34,17.39 44.69,17.03 44.69,12.81 44.22,12.34 42.79,12.34 R28.1 42.77,11.86 43.31,11.33 44.5,11.33 44.83,11 44.83,7.57 44.53,7.26 42.7,7.26 R24.1 42.69,6.69 43.23,6.15 44.53,6.15 44.86,5.82 44.86,2.72 44.4,2.26 42.62,2.26 R21.1 | C38.1 53.08,32.56 49.7,35.94
5V_REG_IN
  Top 0.406: C23.1 57.77,7.81 57.23,8.36 57.23,9.52 D2.C 54.54,9.54 U$26.3
12_V  (via drill 0.35)
  Top 0.305: F3.2 63.25,7.39
  Top 0.61: U$3.B19 12.28,6.64 v12.24,6.6 | 63.25,7.39 v66.52,7.39
  Route11 0.61: 64.28,9.52 63.8,9.99 | 64.28,9.52 66.42,7.38 66.42,7.37 v66.52,7.39 | v12.24,6.6 28.23,6.6 34.29,12.66 61.14,12.66 64.28,9.52
12V  (via drill 0.35)
  Top 0.406: C37.1 48.43,28.27 U$10V2V5.P2 48.43,32.26 v48.39,32.31
  Top 0.61: U$2.3 61.02,4.96 F3.1 61.02,11.47 59.13,13.36 57.23,13.36 D2.A 55.66,13.34 55.61,13.29 54.93,13.29 54.18,14.04 54.18,17.09 U$5.VIN 51.94,19.76 54,21.82 54,26.07 50.88,29.18 49.43,29.18 48.49,28.25 C37.1 47.63,28.25 47.02,27.63 47.02,26.13 R5.1
  Bottom 0.406: v48.39,32.31 46.64,32.31 C9.1
AGND  (via drill 0.35)
  Top 0.254: U$11.P2 27.99,20.77 | 27.99,20.77 U$11.P3 | U12.4 | U4.4 33.02,18.54 32.85,18.38 R31.2 | R27.2 33.02,12.9 33.12,13 34.01,13 U3.4 | R23.2 33.69,7.53 U2.4 | U$12.P3 26.87,7.67 U$12.P2 | 29.61,23.47 28.07,21.92 28.07,20.85 27.99,20.77 | U4.1 33.78,20.49 32.52,20.49 32.13,20.88 30.92,20.88 30.77,20.73 30.77,19.42 31.52,18.67 R31.2 | U3.1 32.57,14.97 32.14,15.4 30.93,15.4 30.78,15.25 30.78,13.94 31.54,13.19 R27.2 | U2.1 32.68,9.4 32.04,10.04 30.83,10.04 30.68,9.89 30.68,8.58 31.43,7.82 R23.2 | R23.2 31.43,6.77 32.91,5.3 33.46,5.3 33.81,4.95 33.81,4.52 U1.1 | R27.2 31.54,12.46 | 33.76,9.41 U2.1 | 27.2,15.57 27.81,16.18 27.81,16.19 27.83,16.2 28.31,16.2 30.48,18.38 R31.2 | U11.1 | U2.1 33.77,9.7 31.53,11.94 R27.2
  Top 0.305: C90.2 26.43,17.56 25.65,18.34 24.32,18.34 23.24,17.26 R79.1 22.48,17.26 21.7,18.04 19.68,18.04 v19.63,18.08 | U$11.P3 28.05,18.93 C90.2 | R76.1 22.47,31.35 23.34,32.23 25.53,32.23 25.58,32.18 25.65,32.18 26.21,31.62 26.21,30.74 C84.2 | C79.2 26.87,30.08 C84.2 | C85.2 27.2,15.57 27.2,17.04 C90.2 | C82.1 21.37,23.7 25.42,19.64 27.11,19.64 27.11,19.63 27.17,19.63 27.42,19.89 27.42,20.76 U$11.P2 | 51.23,13.13 50.9,13.46 50.29,13.46 49.96,13.13 U$5.HEATGND | U$12.P3 27.53,7.65 27.53,6.4 31.42,2.51 R20.2 33.86,2.51 U1.4 33.91,2.46 35.56,2.46 36.17,3.07 36.17,5.33 34.6,6.91 33.84,6.91 33.45,6.52 33.45,5.46 33.88,5.03 U1.1 | 21.46,10.76 21.63,10.76 25.85,6.54 26.7,6.54 26.71,6.54 26.86,6.69 26.86,7.66 26.87,7.67 | 21.46,10.76 C88.1 | C68.2 42.6,25.73 43.56,25.73 43.71,25.88 v43.71,26.92 | v39.57,6.4 40.76,5.21 41.55,5.21 42.33,4.43 C36.2 | C44.2 v43.93,14.59 v43.94,14.58 | C47.2 42.29,20.98 42.29,21.34 41.53,22.1 39.89,22.1 v39.29,22.7 v38.21,22.7 v38.2,22.71 | 50.77,21.9 C10.2 | U$5.HEATGND 49.4,12.47 49.48,12.39 49.48,13.31 | 49.48,13.31 49.48,13.51 49.4,13.59 | R4.1 51.37,25.06 v52.2,25.88 | C41.2 42.48,9.39 41.7,10.17 40.12,10.17 v39.42,10.87 | v48.13,9.25 48.13,11.96 49.48,13.31 | U2.4 35.1,7.45 v36.2,6.35 | v51.03,33.2 51.03,30.95 U$10V2V5.P4 | v20.65,8.74 20.65,8.79 21.49,9.63 21.49,10.73 21.46,10.76 | v27.15,32.33 27.15,30.86 27,30.71 26.25,30.71 C84.2 | U11.4 33.95,22.94 33.35,22.34 33.35,21.8 33.9,21.25 U4.1 | U12.1 34.03,30.76 33.02,30.76 32.5,30.24 32.5,28.1 v31.75,27.36 | v54.33,27.25 54.33,27.96 C38.2 | U12.4 35.48,28.98 36.7,30.2 36.7,30.77 37.33,31.41 37.91,31.41 v38.58,32.07
  Top 0.305: U$5.HEATGND 46.3,13.13 v45.52,13.92 | C71.2 42.54,31.87 v43.26,32.59 | 29.61,23.47 R59.2 | 30.67,23.69 R59.2 | v31.75,27.36 31.8,27.3 33.53,27.3 33.96,26.87 33.96,25.75 | R63.2 30.75,28.35 v31.75,27.36 | 33.96,25.75 U11.1 | 33.78,20.49 32.98,21.29 32.21,21.29 30.89,22.61 R59.2 | R59.2 30.89,23.72 30.11,24.5 30.11,25.83 30.27,25.99 32.77,25.99 33.04,25.73 33.93,25.73 33.96,25.75
  Top 0.406: C10.2 50.75,23.36 R4.1 50.45,24.9 50.45,24.92 50.16,25.22 C37.2 | 50.77,21.9 50.77,21.34 49.4,19.96 U$5.GND 49.4,13.59 | C38.2 51.87,29.2 50.98,30.1 U$10V2V5.P4 | C82.1 18.36,23.7 18.33,23.66 15.45,23.66 U$3.B9 U$3.B14 | U$3.B14 12.65,26.49 14.17,28.02 17.76,28.02 U$3.B1 | R10.2 6.55,21.51 v6.5,21.56 | U$3.B14 11.28,26.49 U$3.B20
  Route6 0.305: v54.91,22.1 54.91,22.64 54.89,22.66 54.89,23.21 54.91,23.23 54.91,25.15 54.18,25.88 v52.2,25.88 52.96,25.88 v54.33,27.25 | v31.75,27.36 31.75,27.74 v27.15,32.33 | v38.2,22.71 38.2,22.81 v42.5,27.1 | v6.5,21.56 6.5,22.45 6.55,22.5
  Bottom 0.305: v39.57,6.4 39.57,6.37 | 39.57,6.37 39.57,5.03 39.57,4.9 39.87,4.61 41.17,4.61 41.18,4.6 C39.1 | v43.94,14.58 41.47,14.58 C45.1 42.13,13.92 v45.52,13.92 | v39.29,22.7 39.29,22.65 C48.1 | v54.91,22.1 IC1.63 | C42.1 39.71,10.87 v39.42,10.87 46.51,10.87 v48.13,9.25 | v36.2,6.35 39.54,6.35 39.57,6.37 | v51.03,33.2 48.46,30.63 C9.2 44.66,32.59 v43.26,32.59 | v19.63,18.08 19.63,14.15 22.4,11.38 22.4,9.45 21.64,8.69 20.7,8.69 v20.65,8.74 | v38.58,32.07 40.11,32.07 41.22,30.96 | C69.1 43.2,26.41 v43.71,26.92 | C69.1 39,28.52 34.51,28.52 34.34,28.68 34.34,30.01 34.54,30.21 38.58,30.21 39.28,30.91 41.04,30.91 C72.1 41.15,31.91 42.06,32.82 42.06,33.32 41.66,33.73 28.55,33.73 v27.15,32.33 | v42.5,27.1 41.81,27.1 C69.1
  Bottom 0.406: C9.2 42.27,30.63 41.94,30.96 41.22,30.96 C72.1
  pour Route6: 6.83,38.46 91.24,38.46 91.31,38.38 91.31,18.9 91.34,18.87 6.05,18.34 6.07,38.53
AVR_SCK  (via drill 0.35)
  Top 0.305: H7.3 63.93,27.63 62.99,26.69 v62.99,26.67
  Bottom 0.305: v62.99,26.67 62.99,24.7 IC1.11
CAN_H  (via drill 0.35)
  Top 0.406: IC2.7 72.76,4.64 71.76,3.63 69.02,3.63 68.69,3.96 IC3.2
  Top 0.61: v11.86,3.17 8.35,6.69 8.35,10.59 9.78,12.02 U$3.B25 | v67.11,4.52 68.62,4.52 IC3.2
  Route6 0.61: v11.86,3.17 38.91,3.17 39.11,2.97 65.56,2.97 v67.11,4.52
CAN_L  (via drill 0.35)
  Top 0.406: IC3.1 69.02,6.51 69.88,7.37 72.09,7.37 73.55,5.9 IC2.6
  Top 0.61: U$3.B26 9.78,6.86 11.99,4.65 v12.07,4.65 | 66.8,5.66 v66.8,5.74 | v66.8,5.74 66.8,5.84 | v66.8,5.74 66.8,5.8 67.49,6.49 68.68,6.49 IC3.1
  Route6 0.61: v12.07,4.65 65.71,4.65 v66.8,5.74
D+  (via drill 0.35)
  Top 0.254: v77.8,24.26 77.8,21.63 78.14,21.28 80.48,21.28 82.23,19.53 82.25,19.53 82.59,19.19 84.85,19.19 85,19.04 85,18.49 U$1.P$3
  Bottom 0.305: IC5.15 77.42,24.64 v77.8,24.26
D-  (via drill 0.35)
  Top 0.254: v76.71,24.26 76.71,21.25 77.34,20.61 80.61,20.61 82.42,18.81 83.4,18.81 84.57,17.64 85.36,17.64 | 85.36,17.64 85.37,17.63 | 85.36,17.64 86.02,17.64 U$1.P$2
  Bottom 0.305: IC5.16 76.77,24.32 v76.71,24.26
DGND  (via drill 0.35)
  Top 0.305: VCC!.C 62.38,3.05 61.04,3.05 58.12,5.96 C23.2 58.42,5.96 60.3,4.08 61.93,4.08 62.1,4.25 62.1,11.22 58.89,14.43 57.36,14.43 56.98,14.81 56.98,15.36 57.75,16.13 SJ1.1 57.75,16.52 55.32,14.1 v55.27,14.1 | 63.32,2.15 63.32,2.16 63.4,2.24 69.81,2.24 R3.2 | H7.6 69.01,35.41 72.9,31.53 72.87,31.57 v72.9,31.55 | C24.2 52.27,2.5 53.6,1.17 58.17,1.17 58.33,1.34 58.33,3.07 58.17,3.23 55.42,3.23 U$26.1 | U$3.B18 11.28,14.49 U$3.B24 10.78,15.99 U$3.B17 U$3.B11
  Top 0.406: IC2.2 81.54,4.64 82.55,3.63 82.55,3.16 81.71,2.32 74.33,2.32 73.08,1.07 70.99,1.07 69.81,2.24 | v70.26,28.7 74.58,28.7 v76.43,30.56 | R10.1 6.55,15.85 v6.53,15.82 | U$2.1 63.32,2.15 VCC!.C | v72.33,5.51 70.95,5.51 IC3.3
  Top 0.61: C23.2 57.77,4.82 57.28,4.33 54.41,4.33 U$26.1
  Route6 0.305: v6.53,15.82 6.53,14.17 6.5,14.15 | U$3.B18 13.51,14.49 14.76,13.24 15.8,13.24 17.05,14.49 38.78,14.49 39.25,14.96 39.26,14.96 40.46,16.17 65.85,16.17 v66.85,17.17 66.85,17.2 71.51,21.86 71.51,23.99 v70.97,24.54
  Bottom 0.305: 79.71,30.33 C18.2 | 79.71,30.33 81.56,30.33 C19.2 | IC1.53 53.21,14.1 v55.27,14.1 60.08,18.91 68.55,18.91 | 79.71,30.33 79.59,30.45 79.59,31.89 79.34,32.14 73.41,32.14 72.87,32.68 IC5.7 72.9,33.61 v72.9,31.55 | 79.71,30.33 79.62,30.25 77.29,30.25 75.47,28.43 IC5.18 75.29,26.57 75.29,27.23 75.1,27.42 73.89,27.42 73.88,27.41 73.71,27.41 73.71,27.38 73.53,27.2 73.53,26.4 IC5.21 | IC5.26 IC5.25 70.97,26.34 v70.97,24.54 | 68.55,18.91 IC1.22 74.52,18.91 C1.1 74.69,19.07 | 68.55,18.91 68.31,18.66 68.01,18.66 66.85,17.51 v66.85,17.17 | 81.04,19.07 84.06,19.07 U$1.P$5
  Bottom 0.406: IC5.26 70.27,28.69 v70.26,28.7 | v76.43,30.56 79.48,30.56 79.59,30.45 | C2.1 81.04,19.07
  Bottom 0.61: 74.69,19.07 C2.1
  pour Route6: 20.02,17.32 91.74,17.73 91.72,17.7 91.72,-1.14 91.62,-1.17 6.05,-1.02 6.02,17.37
DTR  (via drill 0.35)
  Top 0.305: v69.49,28.22 69.49,31.8 v69.57,31.88
  Bottom 0.305: C20.1 71.25,22.8 68.5,25.54 68.5,27.23 v69.49,28.22 69.62,28.35 | v69.57,31.88 69.57,33.59 IC5.2
M8RXD
  Bottom 0.305: R2.1 55.67,35.35 57.06,36.74 67.74,36.74 68.96,35.52 IC5.1
M8TXD
  Bottom 0.305: R7.1 66.78,32.74 68.91,30.61 71.56,30.61 71.58,30.59 IC5.5
N$1  (via drill 0.35)
  Top 0.254: U1.6 40.04,3.15 R21.2
  Top 0.305: R21.2 39.87,2.3 v39.7,2.13
  Bottom 0.254: R22.1 37.49,4.59 C35.2
  Bottom 0.305: v39.7,2.13 39.65,2.13 38.99,1.47 35.26,1.47 34.67,2.06 34.67,4.34 34.9,4.57 35.49,4.57 R22.1
N$2
  Top 0.406: U$5.ENABLE 46.86,20.01 49.48,22.63 49.48,23.97 R4.2 48.89,24.56 R5.2
N$4  (via drill 0.35)
  Top 0.254: R20.1 31.96,4.21 33.02,3.15 U1.3
  Top 0.305: R20.1 31.6,5.23 v31.24,5.59
  Bottom 0.305: v31.24,5.59 31.22,5.59 30.81,5.18 30.81,4.25 R18.2
N$5  (via drill 0.35)
  Top 0.254: R23.1 31.84,9.23 32.97,8.1 U2.3
  Top 0.305: v36.12,10.87 36.12,9.02 35.2,8.1 U2.3
  Bottom 0.305: R19.2 32.71,9.25 33.66,10.2 35.45,10.2 v36.12,10.87
N$6
  Top 0.406: R3.1 71.97,2.24 73.05,3.33 74.38,3.33 IC2.8
N$7  (via drill 0.35)
  Top 0.254: U2.6 40.17,8.1 R24.2 41.28,7.28 42.03,8.03 42.91,8.03 v44.12,9.25
  Route6 0.254: v38.18,11.68 38.79,11.07 38.79,10.61 40.15,9.25 v44.12,9.25
  Bottom 0.254: 36.96,9.37 R25.1 | 36.96,9.37 C40.2 | v38.18,11.68 37.82,11.68 37.03,10.9 37.03,9.45 36.96,9.37
N$8  (via drill 0.35)
  Top 0.254: R27.1 32.26,14.6 33.2,13.66 U3.3
  Top 0.305: v36.32,16.15 36.32,14.76 35.23,13.66 U3.3
  Bottom 0.305: R26.2 32.84,14.6 33.96,15.71 35.88,15.71 v36.32,16.15
N$9
  Top 0.61: VCC!.A 59.37,2.13 R6.1
N$10  (via drill 0.35)
  Top 0.254: U3.6 39.76,13.67 R28.2 41.07,13.18 41.87,13.98 41.87,15.19 41.72,15.34 39.83,15.34 v38.48,16.69
  Bottom 0.254: 37.19,14.88 R29.1 | 37.19,14.88 37.2,14.88 C43.2 | v38.48,16.69 37.8,16.69 37.24,16.13 37.24,14.93 37.19,14.88
N$11
  Bottom 0.406: IC1.24 74.42,17.31 C1.2
  Bottom 0.61: C1.2 74.62,5.11 76.45,3.28 78.76,3.28 Q1.1
N$12  (via drill 0.35)
  Top 0.254: R31.1 32.2,20.08 33.1,19.18 33.89,19.18 U4.3
  Top 0.305: v35.94,22.07 35.94,20.04 35.08,19.18 33.91,19.18 U4.3
  Bottom 0.305: v35.94,22.07 35.29,21.42 34.44,21.42 33.19,20.16 R30.2
N$14  (via drill 0.35)
  Top 0.254: U4.6 40.04,19.19 R32.2
  Top 0.305: R32.2 40.86,18.92 41.86,19.93 41.86,21.16 41.7,21.32 41.69,21.32 41.35,21.67 39.29,21.67 v39.27,21.69
  Bottom 0.254: R33.1 37.32,20.59 C46.2
  Bottom 0.305: v39.27,21.69 38.43,21.69 37.32,20.59
N$22  (via drill 0.35)
  Top 0.305: L1.2 55.61,25.2
  Top 0.406: 55.61,25.2 55.61,23 v55.55,22.94
  Bottom 0.406: v55.55,22.94 53.23,22.94 IC1.64
N$28  (via drill 0.35)
  Top 0.254: U11.3
  Top 0.305: U11.3 34.82,24.43 36.55,26.16 v36.55,26.9 | R59.1 32.31,25.17 v32.41,25.07
  Bottom 0.305: v32.41,25.07 30.95,25.07 R58.2 33.05,25.17 34.28,26.4 36.06,26.4 v36.55,26.9
N$29  (via drill 0.35)
  Top 0.254: U11.6 39.09,24.43 39.11,24.41 39.88,24.41 R60.2 40.87,24.22 41.71,25.05 41.71,26.26 41.56,26.41 39.78,26.41 v39.17,27.02
  Bottom 0.254: R61.1 37.1,25.57 C67.2 37.19,25.69 37.19,26.77 37.44,27.02 v39.17,27.02
N$30  (via drill 0.35)
  Top 0.254: 34.18,29.64 U12.3
  Top 0.305: U12.3 34.21,29.64 35.38,29.64 36.12,30.38 v36.12,32.38 36.02,32.49 31.65,32.49 30.75,31.59 R63.1
  Bottom 0.305: R62.2 30.67,32.32 30.99,32.64 35.86,32.64 v36.12,32.38
N$31  (via drill 0.35)
  Top 0.254: U12.6 39.28,29.63 39.29,29.62 39.86,29.62 R64.2 40.84,29.55 41.64,30.35 41.64,31.89 v40.77,32.77
  Bottom 0.254: R65.1 37.16,31.05 C70.2 37.21,31.1 37.21,32.49 37.49,32.77 v40.77,32.77
N$32
  Bottom 0.305: IC5.23 72.22,24.99 LED2.C
N$34
  Bottom 0.305: IC5.22 72.87,25.43 73.13,25.17 73.83,25.17 LED3.C
N$35
  Bottom 0.406: LED2.A 73.04,22.59 73.62,23.17 74.1,23.17 74.1,23.18 79.04,23.18 79.45,23.58 R8.1
N$36
  Bottom 0.406: LED3.A 80.79,22.24 81.94,23.39 R9.1
N$40
  Top 0.406: C89.1 25.27,13.3 24.9,12.93 24.85,12.93 R77.2 23.21,10.82 C88.2 23.14,9.93 25.43,7.64 26.19,7.64 U$12.P1
N$41
  Top 0.254: C83.2 24.97,28.09 26.75,26.31 26.75,24.88 U$11.P8
  Top 0.406: R75.1 22.93,28.09 C83.2 24.71,30.55 C84.1
N$42
  Top 0.254: C89.2 25.28,15.44 26.19,14.53
  Top 0.305: 26.19,14.53 26.19,11.79 U$12.P8
  Top 0.406: C90.1 25.28,17.26 C89.2 23.81,15.65 R78.1
N$43
  Top 0.254: C82.2 23.17,23.7 26.11,20.75 26.73,20.75 U$11.P1
  Top 0.406: R74.2 C82.2 | R74.2 | R74.2 24.25,25.93 C83.1
RESET  (via drill 0.35)
  Top 0.305: 56.85,19.94 D1.A 57.42,20.03 C16.1 61.47,22.43 66.5,27.46 66.5,28.57 | SJ1.2 56.85,19.94 | R1.1 58.9,17.89 56.85,19.94 | 66.5,28.57 66.5,29.28 H7.5 | v67.39,26.01 67.39,27.69 66.5,28.57
  Bottom 0.305: IC1.20 68.96,20.75 69.43,20.75 69.59,20.91 69.59,23.8 v67.39,26.01
  Bottom 0.406: IC1.20 71.22,20.51 C20.2
RX  (via drill 0.35)
  Top 0.305: H7.4 63.51,35.41 62.14,34.04 60.27,34.04 60.26,34.04 53.89,34.04 53.47,33.62 53.47,33.58 v53.49,33.55
  Bottom 0.305: 55.67,30.66 55.67,24.75 IC1.2 | 55.67,30.66 R2.2 56.1,30.79 | v53.49,33.55 53.49,32.84 55.67,30.66
RXCAN  (via drill 0.35)
  Top 0.406: IC2.4 77.7,7.18 76.05,8.83 67.21,8.83 65.43,10.6 65.43,11.58 v65.38,11.63
  Bottom 0.406: v65.38,11.63 68.64,11.63 IC1.31
SG5V  (via drill 0.35)
  Top 0.406: U$5.VOUT 50.67,20.15 C10.1 53.19,22.67 v53.19,24.41
  Route6 0.406: v29.06,17.86 46.63,17.86 v53.19,24.41
  Bottom 0.406: R30.1 29.66,18.46 v29.06,17.86 | R30.1 30.98,16.97 30.66,16.65 30.66,16.64 30.18,16.15 30.18,16.14 30.01,15.98 30,15.98 29.95,15.93 29.95,15.29 29.94,15.29 29.94,13.91 29.95,13.91 29.95,13.16 30.19,12.92 30.75,12.92 R26.1 30.77,11.52 29.59,10.34 29.59,7.85 29.9,7.54 30.67,7.54 R19.1 30.68,6.37 30.01,5.7 30.01,5.68 29.57,5.23 29.57,3.75 R18.1 | 30.86,23.29 R58.1 | 30.86,23.29 30.86,22.32 30.1,21.56 30.1,19.34 R30.1 | R62.1 30.67,27.25 30.05,26.63 30.05,25.87 30.03,25.85 30.03,24.12 30.86,23.29
SG_1  (via drill 0.35)
  Top 0.305: v34.11,6.25 34.16,6.25 35.1,5.31 35.1,4.01 34.87,3.78 33.89,3.78 U1.2
  Top 0.406: U$3.B7 19.67,9.99 v20.07,9.99
  Route6 0.406: v20.07,9.99 30.38,9.98 v34.11,6.25 34.19,6.17
SG_2  (via drill 0.35)
  Top 0.254: v35.03,11 35.03,9.07 34.72,8.76 33.79,8.76 U2.2
  Top 0.406: U$3.B13 19.67,11.49 v19.69,11.48
  Route6 0.406: v19.69,11.48 34.54,11.48 v35.03,11
SG_3  (via drill 0.35)
  Top 0.254: v35.26,16.84 35.26,14.76 34.82,14.32 U3.2
  Route6 0.406: U$3.B5 17.81,15.99 18.61,16.79 35.24,16.79 35.27,16.76 35.27,16.83 v35.26,16.84
SG_4  (via drill 0.35)
  Top 0.254: v34.01,22.07 34.32,22.07 35.05,21.34 35.05,20.12 34.8,19.86 33.93,19.86 U4.2
  Top 0.406: U$3.B4 v20.16,18.99 v20.17,19
  Route6 0.406: v20.17,19 30.94,19 v34.01,22.07
SG_5  (via drill 0.35)
  Top 0.254: 33.89,25.02 U11.2
  Top 0.305: 33.94,25.09 U11.2 33.36,25.08 32.54,24.26 32.54,22 v32.49,21.94
  Top 0.406: U$3.B10 20.21,20.49 v20.27,20.55
  Route6 0.406: v20.27,20.55 31.09,20.55 v32.49,21.94
SG_6  (via drill 0.35)
  Top 0.305: v35.71,27.3 34.52,28.5 33.25,28.5 32.93,28.82 32.93,30.06 33.12,30.25 34.17,30.25 U12.2
  Top 0.406: U$3.B3 20.4,21.99 v20.42,21.97
  Route6 0.406: v35.71,27.3 34.29,25.88 31.62,25.88 31.04,25.3 31.04,22.48 30.53,21.97 v20.42,21.97
SGO1  (via drill 0.35)
  Top 0.254: U1.7 39.43,3.8 v39.45,3.78
  Bottom 0.254: R22.2 37.49,2.89 C35.1 | v39.45,3.78 40.45,3.78 C39.2
  Bottom 0.406: IC1.56 53.19,16.5 51.96,16.5 50.3,14.85 50.3,7.72 45.48,2.9 C39.2 41.28,2.84 C35.1
SGO2  (via drill 0.35)
  Top 0.254: U2.7 39.38,8.75 v39.4,8.76
  Bottom 0.254: R25.2 36.96,7.67 C40.1 | v39.4,8.76 40.12,8.76 C42.2
  Bottom 0.406: C40.1 40.92,7.59 C42.2 48.72,7.77 49.35,8.41 49.35,14.93 51.66,17.25 53.14,17.25 IC1.57
SGO3  (via drill 0.35)
  Top 0.254: U3.7 39.51,14.32 v39.52,14.3
  Bottom 0.254: v39.52,14.3 39.95,14.3 C45.2 | R29.2 37.2,13.18 C43.1
  Bottom 0.406: C43.1 41.2,13.15 C45.2 47.91,13.09 48.54,13.72 48.54,15 51.61,18.07 53.16,18.07 IC1.58
SGO4  (via drill 0.35)
  Top 0.254: U4.7 v39.34,19.84 | v39.34,19.84
  Bottom 0.254: v39.34,19.84 40.25,19.84 C48.2 | R33.2 37.32,18.89 C46.1
  Bottom 0.406: C46.1 41.02,18.83 C48.2 41.22,16.45 41.76,15.91 48.25,15.91 48.96,16.62 48.96,16.64 51.27,18.95 53.16,18.95 IC1.59
SGO5  (via drill 0.35)
  Top 0.254: U11.7 39.34,25.08 v39.37,25.04
  Bottom 0.254: 40.64,24.99 C69.2 40.59,25.04 v39.37,25.04 | R61.2 37.1,23.87 C67.1
  Bottom 0.406: C67.1 40.38,23.97 C69.2 42.48,24.71 43.84,23.34 43.84,17.72 44.6,16.95 47.78,16.95 47.87,17.04 47.87,17.12 50.51,19.76 53.14,19.76 IC1.60
SGO6  (via drill 0.35)
  Top 0.254: U12.7 39.52,30.28 v39.55,30.25
  Bottom 0.254: R65.2 37.16,29.35 C70.1 | v39.55,30.25 40.23,30.25 C72.2
  Bottom 0.406: C70.1 41.1,29.38 C72.2 43.43,29.33 44.65,28.1 44.65,18.26 45.06,17.86 47.21,17.86 47.54,18.19 47.57,18.19 49.81,20.42 53.11,20.42 IC1.61
TCI1+
  Top 0.406: U$3.B2 19.18,24.99 20.07,25.88 21.06,25.88 R74.1
TCI1-
  Top 0.406: U$3.B8 19.63,26.49 R75.2 21.16,29.78 R76.2
TCI2+
  Top 0.406: U$3.B6 21.44,12.99 R77.1
TCI2-
  Top 0.406: U$3.B12 20.96,14.49 R78.2 21.5,15.43 21.08,15.85 21.08,17.21 R79.2
TCO1  (via drill 0.35)
  Top 0.254: U$11.P6 U$11.P5 28.7,25.94 v29.34,26.57
  Route6 0.254: 35.97,27.94 35.45,27.94 34.08,26.57 34.02,26.57 | 35.97,27.94 36,27.91 | 55.12,16.97 55,16.85 v54.99,16.86 | 35.97,27.94 53.98,27.94
  Route6 0.305: v54.99,16.86 58.75,16.86 59.66,17.78 59.66,27.38 59.09,27.95 35.99,27.95 35.98,27.96 35.44,27.96 35.43,27.95 35.41,27.95 34.02,26.57 v29.34,26.57
  Bottom 0.406: v54.99,16.86 54.99,16.1 54.61,15.72 53.21,15.72 IC1.55
TCO2  (via drill 0.35)
  Top 0.254: U$12.P6 U$12.P5 28.16,12.62 v28.7,13.16
  Route6 0.305: v55.35,15.16 53.34,13.16 v28.7,13.16
  Bottom 0.305: v55.35,15.16 54.79,15.16 54.53,14.91 IC1.54
  Bottom 0.406: IC1.54
TX  (via drill 0.35)
  Top 0.305: H7.1 59.59,29.31 59.56,29.29 v59.46,29.29
  Bottom 0.305: IC1.3 56.57,25.83 57.95,27.21 R7.2 59.46,29.33 v59.46,29.29
TXCAN  (via drill 0.35)
  Top 0.406: IC2.1 76.72,3.37 76.23,3.86 76.23,7.9 75.83,8.29 66.87,8.29 64.58,10.58 64.58,12.48 v64.54,12.52
  Bottom 0.406: v64.54,12.52 68.7,12.52 IC1.30
VCC  (via drill 0.35)
  Top 0.254: U$11.P7 27.4,26.06 28.55,27.2 28.55,27.91 28.57,27.93 C79.1 | U$12.P7 26.86,12.59 28.91,14.63 28.91,15.29 | U3.8 38.16,14.93 40.72,14.93 C44.1 | U4.8 38.09,20.49 40.97,20.49 C47.1 | 40.89,25.68 C68.1 40.83,25.73 U11.8 | 38.51,30.93 U12.8 | 38.51,30.93 40.81,30.93 C71.1 | U2.8 C41.1 | 38.18,4.45 U1.8 37.98,5.75 36.73,7 36.73,9.04 37.08,9.4 U2.8 | 38.18,4.45 40.87,4.45 C36.1 | U$26.4 45.31,3.34 45.31,2.01 44.38,1.07 38.83,1.07 38.81,1.09 38.15,1.09 37.13,2.12 37.13,4.1 37.44,4.42 38.15,4.42 38.18,4.45 | U2.8 37.87,10.84 36.55,12.17 36.55,14.32 37.19,14.96 38.11,14.96 U3.8 | U3.8 38.12,15.88 36.8,17.2 36.8,20.07 37.21,20.47 37.99,20.47 U4.8 | U4.8 38,21.74 36.8,22.94 36.8,25.35 37.16,25.7 38.03,25.7 U11.8 | U11.8 38.05,27.25 37.11,28.19 37.11,30.61 37.41,30.91 38.49,30.91 38.51,30.93
  Top 0.305: C85.1 28.9,15.59 30.49,17.18 34.09,17.18 34.61,17.7 36.04,17.7 36.37,18.03 36.37,20.37 36.91,20.9 37.67,20.9 38.09,20.49 | 60.78,20.03 61.07,20.03 | 61.07,20.03 61.8,19.3 61.8,16.41 61.39,16 59.71,16 R1.2 58.53,15.99 v57.63,15.09 | v51.41,8.15 53.04,8.15 U$26.2 | D1.C 60.78,20.03 | 61.07,20.03 66.07,20.03 v66.42,19.68 | v70.92,29.62 v70.92,31.87 v70.92,31.88 | 58.64,25.22 L1.1 58.61,24.45 56.92,22.76 56.9,22.76 v55.22,21.08 55.17,21.03 | v61.26,21.16 61.26,20.51 60.78,20.03 | v73.37,27.99 73.37,27.7 v75.97,25.09 | U$3.B23 10.78,18.99 U$3.B16 12.28,23.34 | 12.28,23.34 U$3.B15 | 12.28,23.34 10.63,24.99 U$3.B21 U$3.B22
  Top 0.406: C24.1 48.57,4.3 U$26.4 54.13,6.59 U$26.2 | H7.2 58.65,35.41 v58.62,35.43 | v83.21,6.5 83.21,11.98 85.06,13.83 85.06,16.82 U$1.P$1 | C71.1 40.84,31.3 37.78,34.35 28.93,34.35 28.55,33.97 28.55,27.95 28.57,27.93
  Top 0.61: C85.1 28.9,15.29 28.91,15.29 | U$26.2 54.37,6.45 52.86,4.94 52.86,2.79 52.83,2.77 52.93,2.77 53.51,2.2 R6.2 | H7.2 61.6,35.41 63.12,36.93 64.75,36.93 65,36.68 65,34.14 62.46,31.6 62.46,27.69 59.99,25.22 58.64,25.22 | U$26.4 46.09,6.59 v46.05,6.55 | v83.21,6.5 83.21,6.43 82.68,5.89 80.59,5.89 IC2.3 | v7.75,26.59 8.18,26.59 U$3.B21 | 28.75,28.29 C79.1
  Route11 0.406: 26.71,13.63 26.68,13.63 | v58.62,35.43 69,35.37 v70.08,36.37
  Route11 0.61: 83.02,6.49 v83.21,6.5 | 83.1,6.41 v83.21,6.5 | 7.63,27.29 7.61,27.27 v7.75,26.59 | v83.21,6.5 v83.21,6.49 79.41,2.69 49.91,2.69 v46.05,6.55
  Bottom 0.305: v51.41,8.15 51.44,8.13 51.44,8.09 51.38,8.14 51.38,12.04 52.65,13.31 IC1.52 55.6,13.31 57.38,15.09 v57.63,15.09 | v66.42,19.68 68.7,19.68 IC1.21 | 70.99,29.54 v70.92,29.62 70.92,28.22 71.25,27.89 73.26,27.89 v73.37,27.99 | IC5.4 v70.92,31.88 | IC5.4 70.92,34.75 71.22,35.05 80.21,35.05 83.44,31.83 83.44,29.35 83.45,29.34 83.45,28.99 83.17,28.71 81.98,28.71 81.94,28.75 | 74.22,26.43 IC5.20 IC5.19 74.83,25.5 75.13,25.2 75.4,25.2 75.51,25.09 v75.97,25.09 | v55.22,21.08 61.19,21.08 v61.26,21.16 | v70.08,36.37 70.89,35.56 70.89,33.66 IC5.4
  Bottom 0.406: R8.2 81.91,26.33 R9.2 81.94,28.75 C19.1
  pour Route11: 6.72,38.8 90.79,38.8 90.84,38.75 90.84,-0.83 6.85,-0.83 6.72,-0.95
VCC3O
  Bottom 0.305: C18.1 76.94,28.43 76.11,27.61 IC5.17
XTAL1  (via drill 0.35)
  Route6 0.406: v76.61,15.29 75.49,15.29 v72.69,18.08
  Bottom 0.406: 78.71,17.21 C2.2 | Q1.2 78.86,13.04 v76.61,15.29 | v72.69,18.08 68.74,18.08 IC1.23
  Bottom 0.61: C2.2 78.71,12.51 78.59,12.39 78.59,12.71 Q1.2

### Text on the board
200bmp: C:/Users/Aiku/Downloads/CPRacingSLO-BW-Final(1).bmp